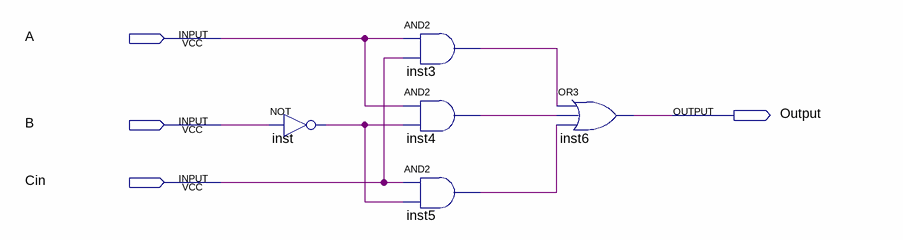
[diagram p0: schematic sheet]
// Quartus schematic Comparador-.bdf as structural Verilog: 5 symbols, 4 pins
module \Comparador-  (
  input  A,
  input  B,
  input  Cin,
  output Output
);

  wire inst3_out, inst4_out, inst5_out, inst_out;

  not inst (inst_out, B);
  and inst3 (inst3_out, A, Cin);
  and inst4 (inst4_out, A, inst_out);
  and inst5 (inst5_out, Cin, inst_out);
  or inst6 (Output, inst3_out, inst4_out, inst5_out);
endmodule
